# Altium schematic sheet S7CAS-PLEIADES-CARTE-MERE_P06_ETHERNET.SCHDOC
size Tabloid; SheetNumber: 11; SheetTotal: 18; Sheet_Name: ETHERNET; Size: 11x17
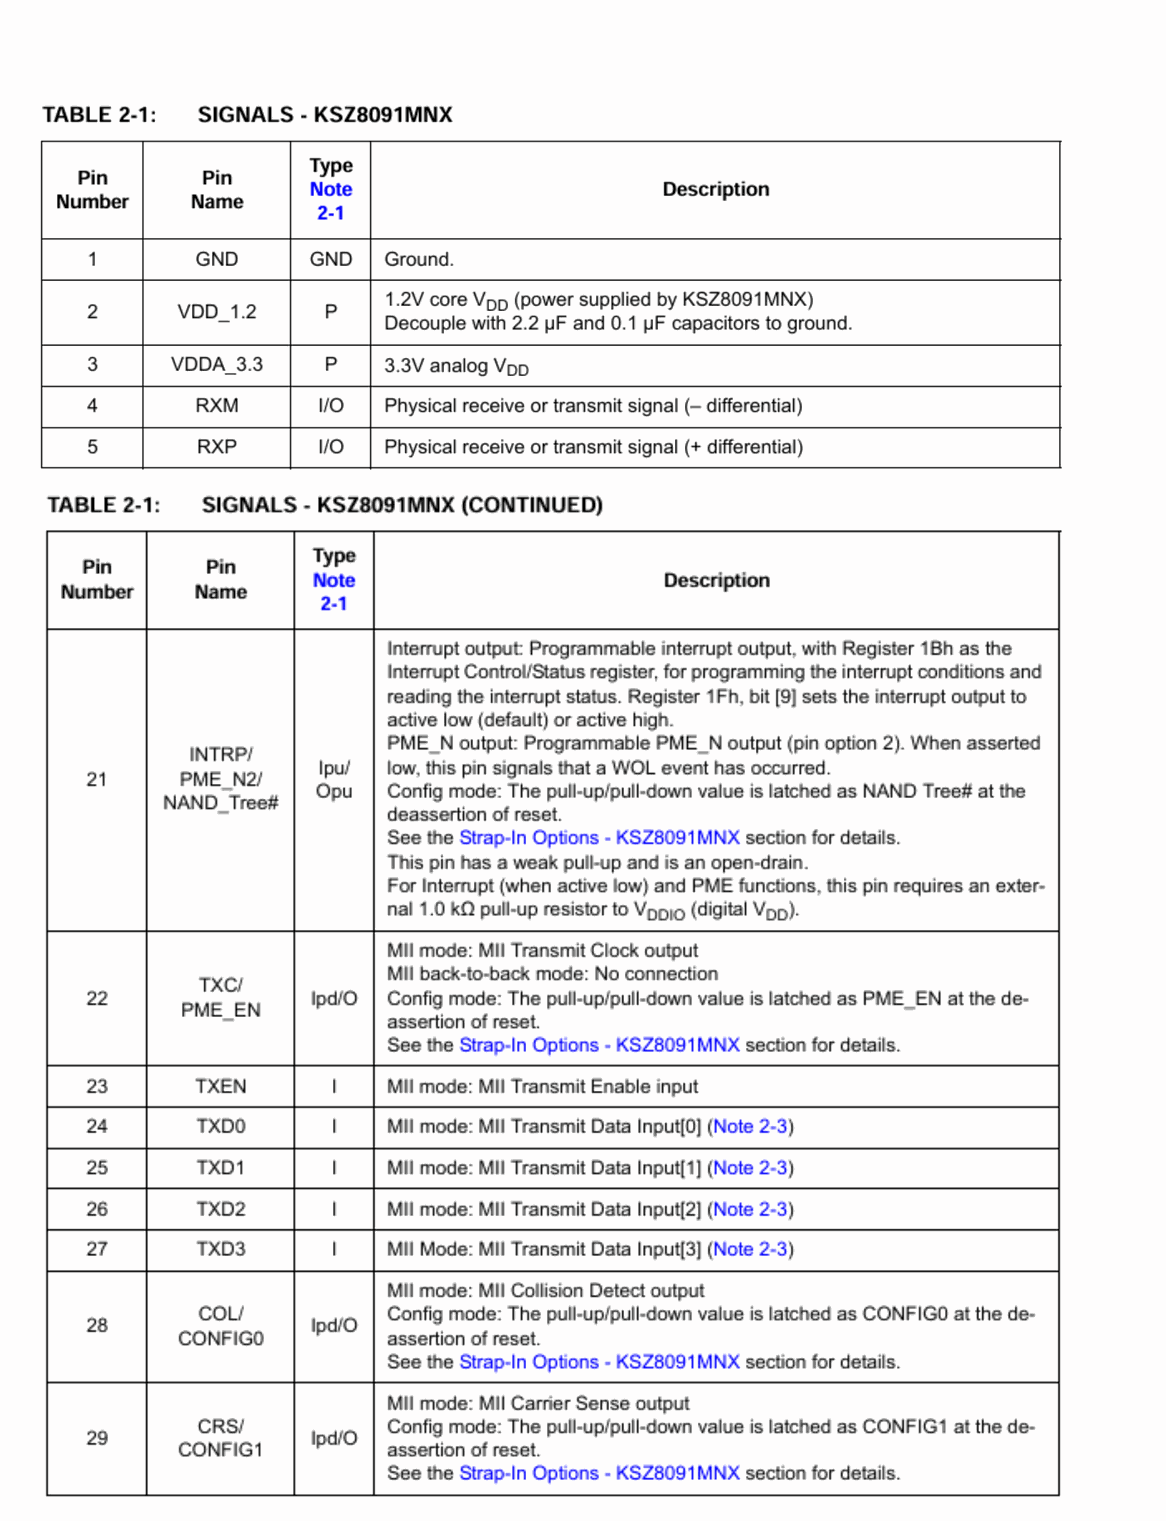
[diagram p0: S7CAS-PLEIADES-CARTE-MERE_P06_ETHERNET.SCHDOC, top left]
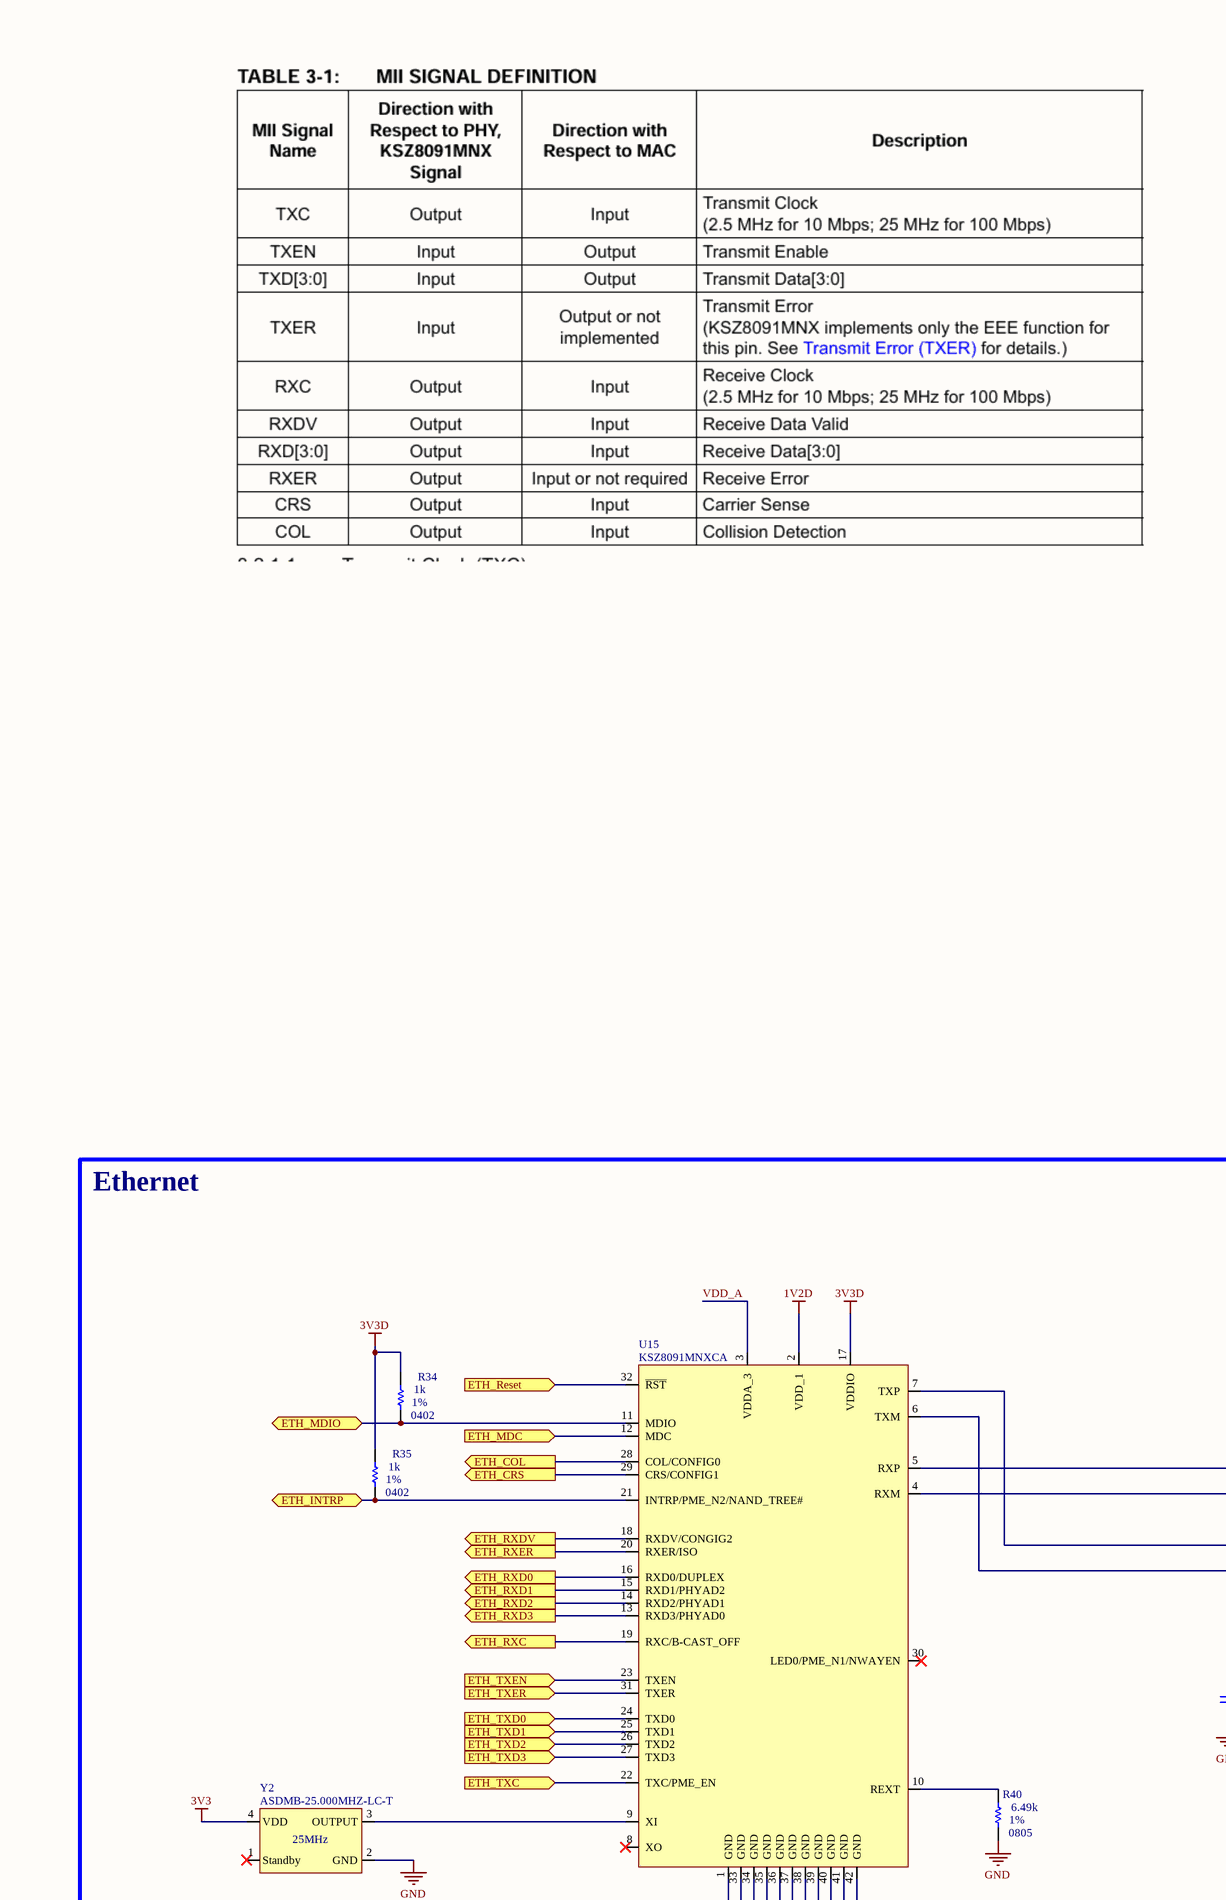
[diagram p1: S7CAS-PLEIADES-CARTE-MERE_P06_ETHERNET.SCHDOC, top middle]
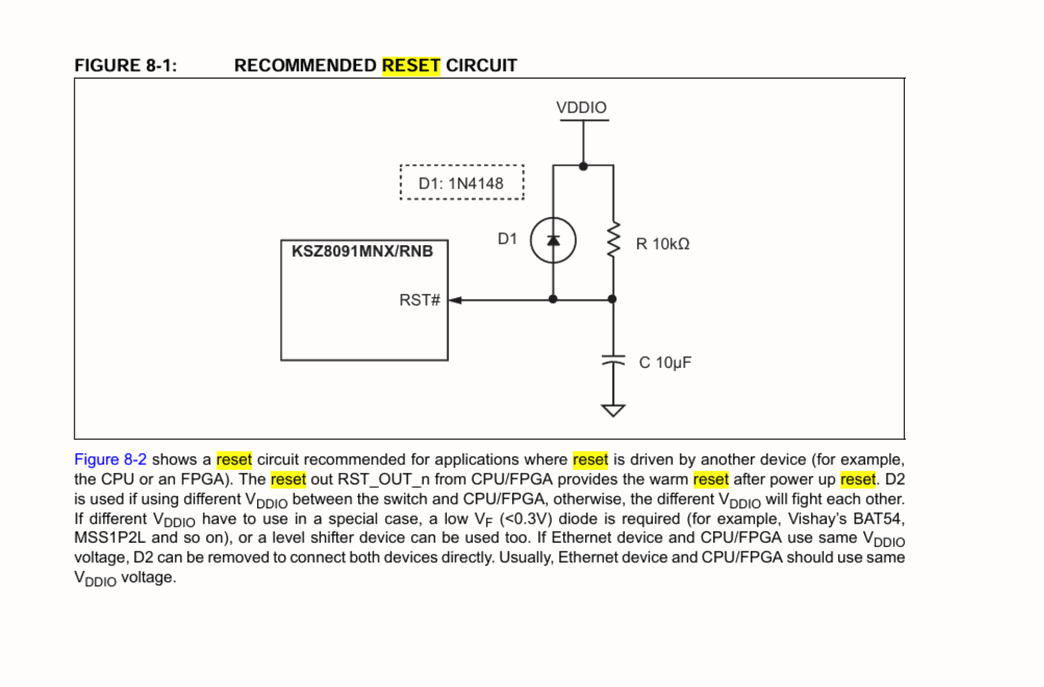
[diagram p2: S7CAS-PLEIADES-CARTE-MERE_P06_ETHERNET.SCHDOC, top right]
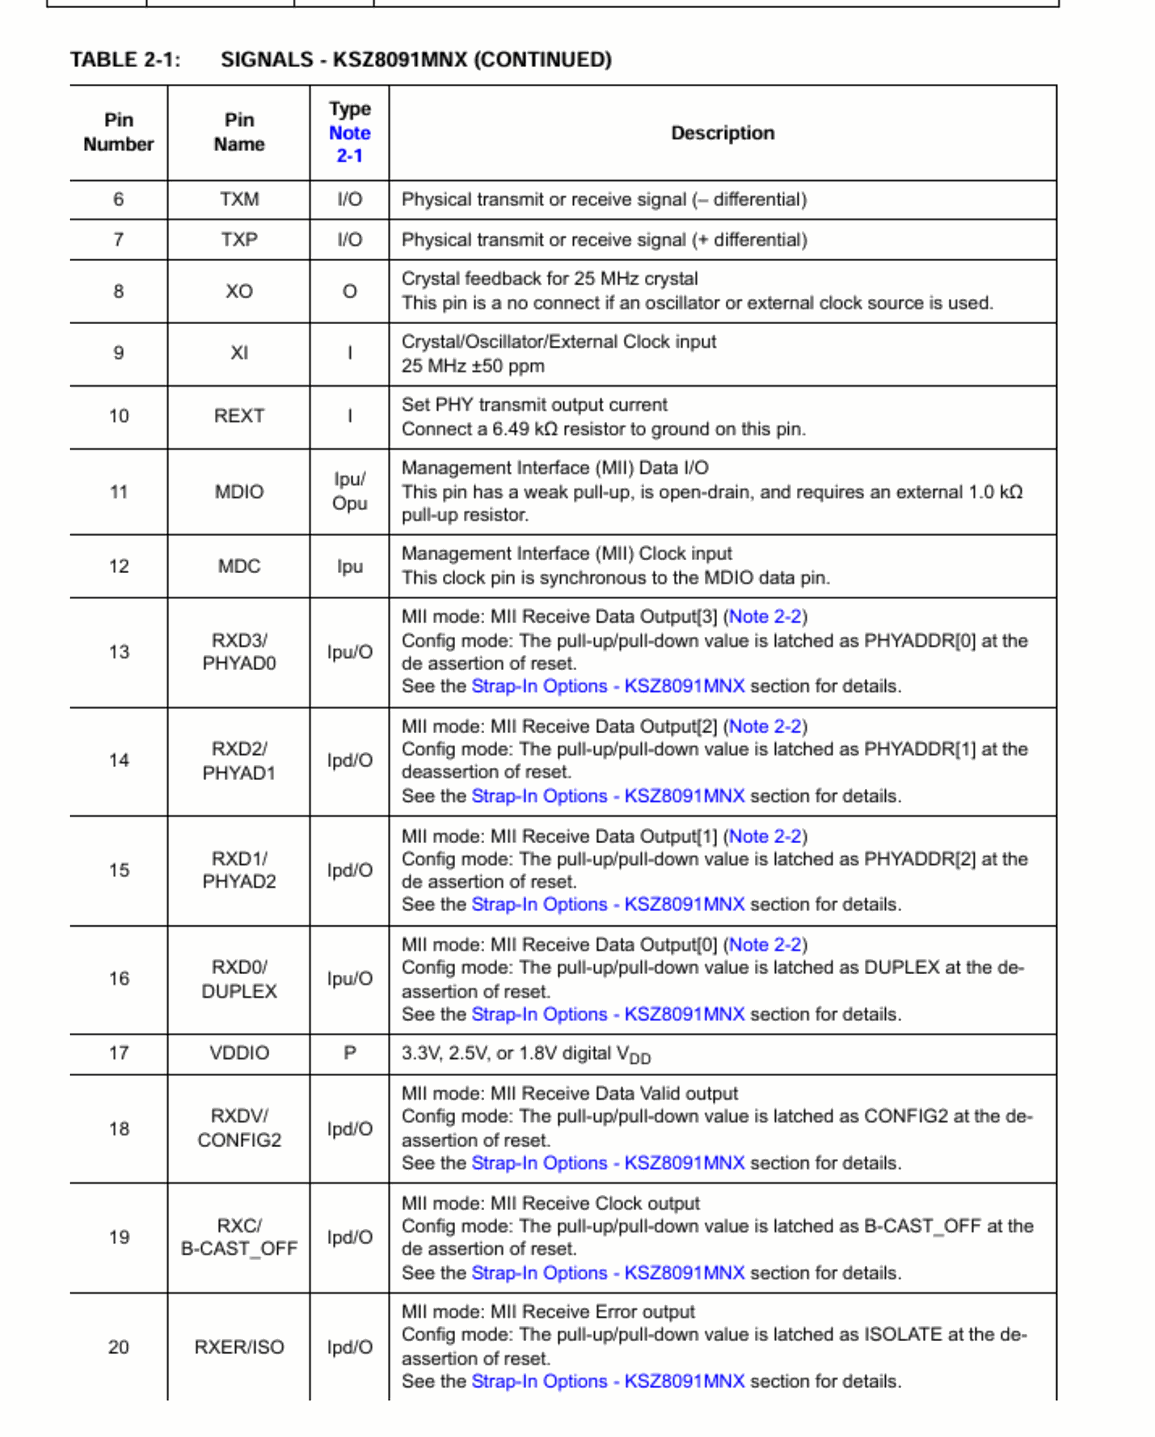
[diagram p3: S7CAS-PLEIADES-CARTE-MERE_P06_ETHERNET.SCHDOC, bottom left]
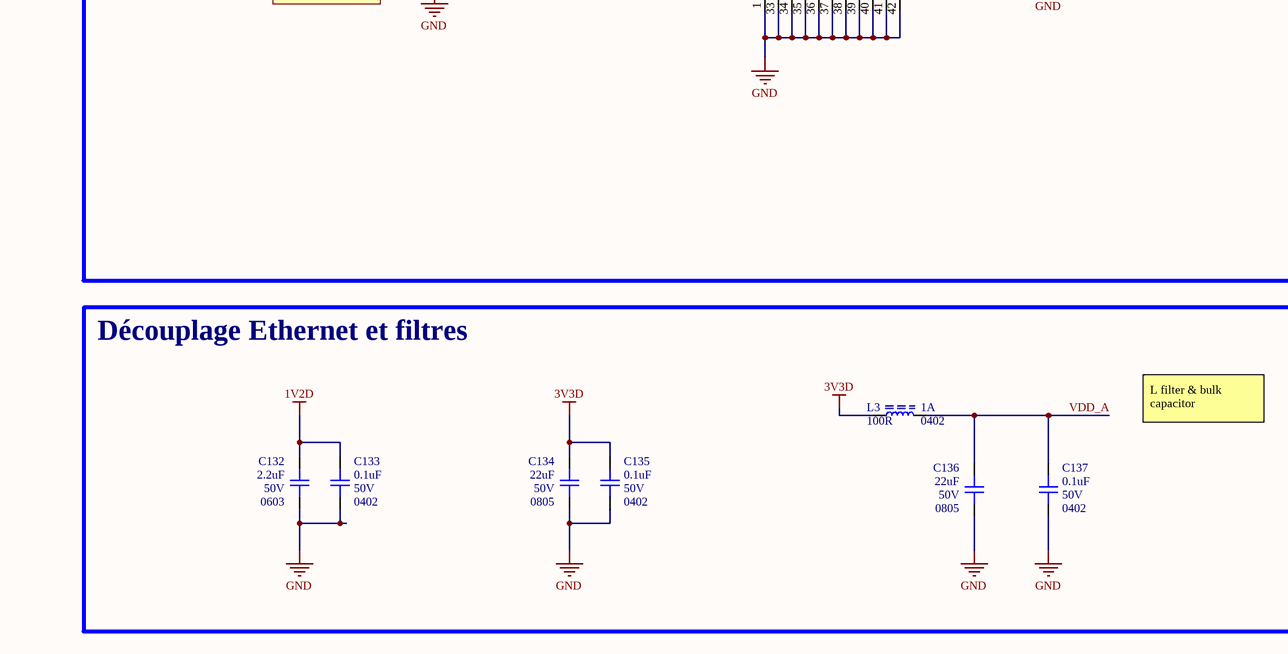
[diagram p4: S7CAS-PLEIADES-CARTE-MERE_P06_ETHERNET.SCHDOC, bottom middle]
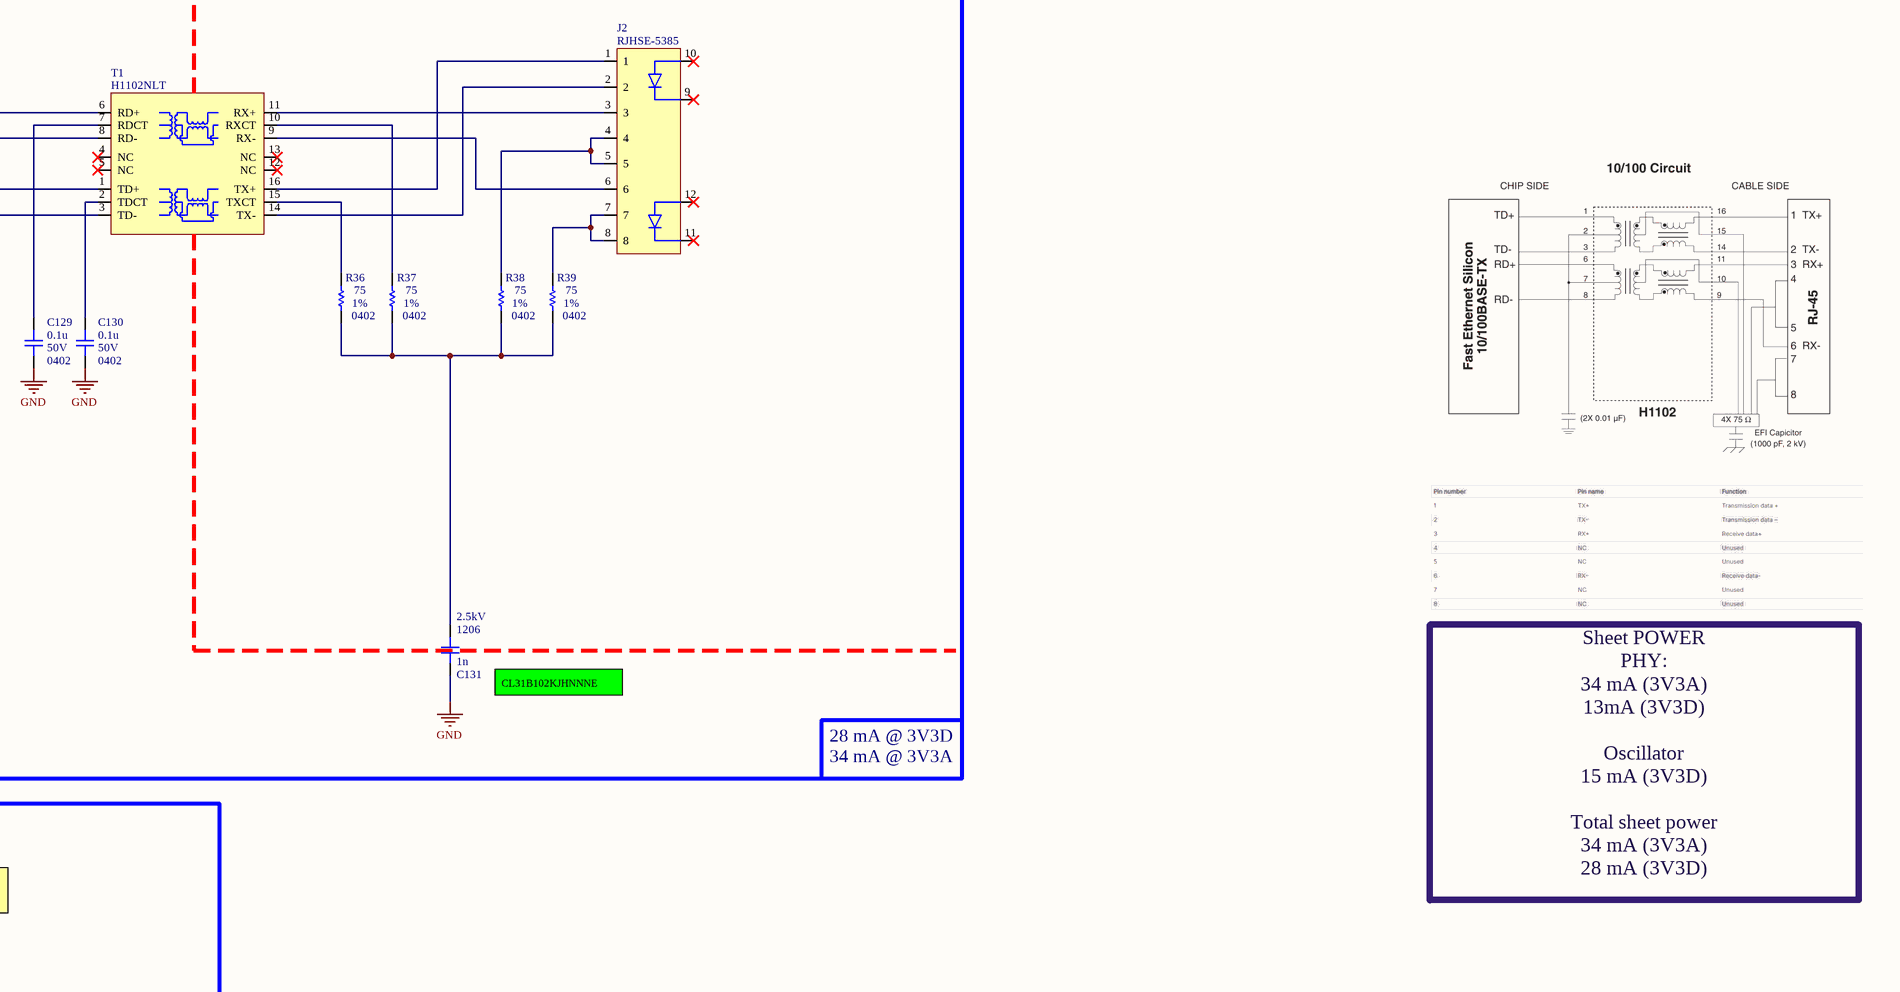
[diagram p5: S7CAS-PLEIADES-CARTE-MERE_P06_ETHERNET.SCHDOC, bottom right]

## Parts
C129  value 0.1u  Voltage: 50V  Package: 0402  [CAP_0402]  (hidden comment: CAP - 0402)
C130  value 0.1u  Voltage: 50V  Package: 0402  [CAP_0402]  (hidden comment: CAP - 0402)
C131  value 1n  Voltage: 2.5kV  Package: 1206  [CAP_0402]  (hidden comment: CAP - 0402)
C132  value 2.2uF  Voltage: 50V  Package: 0603  [CAP_0603]  (hidden comment: CAP - 0603)
C133  value 0.1uF  Voltage: 50V  Package: 0402  [CAP_0402]  (hidden comment: CAP - 0402)
C134  value 22uF  Voltage: 50V  Package: 0805  [CAP_0805]  (hidden comment: CAP - 0805)
C135  value 0.1uF  Voltage: 50V  Package: 0402  [CAP_0402]  (hidden comment: CAP - 0402)
C136  value 22uF  Voltage: 50V  Package: 0805  [CAP_0805]  (hidden comment: CAP - 0805)
C137  value 0.1uF  Voltage: 50V  Package: 0402  [CAP_0402]  (hidden comment: CAP - 0402)
J2  RJHSE-5385  [CONN_ETHERNET_RJHSE-5385]
L3  value 100R  Current: 1A  Package: 0402  [FER_0402]  (hidden comment: FER - 0402)
R34  value 1k  Package: 0402  Precision: 1%  [RES_0402]  (hidden comment: RES - 0402)
R35  value 1k  Package: 0402  Precision: 1%  [RES_0402]  (hidden comment: RES - 0402)
R36  value 75  Package: 0402  Precision: 1%  [RES_0402]  (hidden comment: RES - 0402)
R37  value 75  Package: 0402  Precision: 1%  [RES_0402]  (hidden comment: RES - 0402)
R38  value 75  Package: 0402  Precision: 1%  [RES_0402]  (hidden comment: RES - 0402)
R39  value 75  Package: 0402  Precision: 1%  [RES_0402]  (hidden comment: RES - 0402)
R40  value 6.49k  Package: 0805  Precision: 1%  [RES_0805]  (hidden comment: RES - 0805)
T1  H1102NLT  [TRANSFO_H1102NLT]
U15  KSZ8091MNXCA  [COM_ETH_PHY_KSZ8091MNXCA]
Y2  ASDMB-25.000MHZ-LC-T  [OSC_ASDMB-25.000MHZ-LC-T]

## Blocks framed on the sheet
Ethernet: C129-C131 J2 R34-R40 T1 U15 Y2
Découplage Ethernet et filtres: C132-C137 L3

## Ports
ETH_COL (out, see S7CAS-PLEIADES-CARTE-MERE_P06_FPGA3[1A]), ETH_CRS (out, see S7CAS-PLEIADES-CARTE-MERE_P06_FPGA3[1A]), ETH_INTRP (bidir, see S7CAS-PLEIADES-CARTE-MERE_P06_FPGA3[1B]), ETH_MDC (in, see S7CAS-PLEIADES-CARTE-MERE_P06_FPGA3[1A]), ETH_MDIO (bidir, see S7CAS-PLEIADES-CARTE-MERE_P06_FPGA3[1A]), ETH_Reset (in, see S7CAS-PLEIADES-CARTE-MERE_P06_FPGA3[1A]), ETH_RXC (out, see S7CAS-PLEIADES-CARTE-MERE_P06_FPGA3[1B]), ETH_RXD0 (out, see S7CAS-PLEIADES-CARTE-MERE_P06_FPGA3[1B]), ETH_RXD1 (out, see S7CAS-PLEIADES-CARTE-MERE_P06_FPGA3[1B]), ETH_RXD2 (out, see S7CAS-PLEIADES-CARTE-MERE_P06_FPGA3[1B]), ETH_RXD3 (out, see S7CAS-PLEIADES-CARTE-MERE_P06_FPGA3[1B]), ETH_RXDV (out, see S7CAS-PLEIADES-CARTE-MERE_P06_FPGA3[1B]), ETH_RXER (out, see S7CAS-PLEIADES-CARTE-MERE_P06_FPGA3[1B]), ETH_TXC (in, see S7CAS-PLEIADES-CARTE-MERE_P06_FPGA3[1B]), ETH_TXD0 (in, see S7CAS-PLEIADES-CARTE-MERE_P06_FPGA3[1B]), ETH_TXD1 (in, see S7CAS-PLEIADES-CARTE-MERE_P06_FPGA3[1B]), ETH_TXD2 (in, see S7CAS-PLEIADES-CARTE-MERE_P06_FPGA3[1B]), ETH_TXD3 (in, see S7CAS-PLEIADES-CARTE-MERE_P06_FPGA3[1B]), ETH_TXEN (in, see S7CAS-PLEIADES-CARTE-MERE_P06_FPGA3[1B]), ETH_TXER (in, see S7CAS-PLEIADES-CARTE-MERE_P06_FPGA3[1B])

## Nets
1V2D: C132.2 C133.2 U15.2(VDD_1)
3V3: Y2.4(VDD)
3V3D: C134.2 C135.2 L3.2 R34.2 R35.2 U15.17(VDDIO)
GND: C129.1 C130.1 C131.2 C132.1 C133.1 C134.1 C135.1 C136.1 C137.1 R40.1 U15.1(GND) U15.33(GND) U15.34(GND) U15.35(GND) U15.36(GND) U15.37(GND) U15.38(GND) U15.39(GND) U15.40(GND) U15.41(GND) U15.42(GND) Y2.2(GND)
ETH_COL: U15.28(COL/CONFIG0) ; port ETH_COL
ETH_CRS: U15.29(CRS/CONFIG1) ; port ETH_CRS
ETH_INTRP: R35.1 U15.21(INTRP/PME_N2/NAND_TREE#) ; port ETH_INTRP
ETH_MDC: U15.12(MDC) ; port ETH_MDC
ETH_MDIO: R34.1 U15.11(MDIO) ; port ETH_MDIO
ETH_Reset: U15.32(~{RST}) ; port ETH_Reset
ETH_RXC: U15.19(RXC/B-CAST_OFF) ; port ETH_RXC
ETH_RXD0: U15.16(RXD0/DUPLEX) ; port ETH_RXD0
ETH_RXD1: U15.15(RXD1/PHYAD2) ; port ETH_RXD1
ETH_RXD2: U15.14(RXD2/PHYAD1) ; port ETH_RXD2
ETH_RXD3: U15.13(RXD3/PHYAD0) ; port ETH_RXD3
ETH_RXDV: U15.18(RXDV/CONGIG2) ; port ETH_RXDV
ETH_RXER: U15.20(RXER/ISO) ; port ETH_RXER
ETH_TXC: U15.22(TXC/PME_EN) ; port ETH_TXC
ETH_TXD0: U15.24(TXD0) ; port ETH_TXD0
ETH_TXD1: U15.25(TXD1) ; port ETH_TXD1
ETH_TXD2: U15.26(TXD2) ; port ETH_TXD2
ETH_TXD3: U15.27(TXD3) ; port ETH_TXD3
ETH_TXEN: U15.23(TXEN) ; port ETH_TXEN
ETH_TXER: U15.31(TXER) ; port ETH_TXER
VDD_A: C136.2 C137.2 L3.1 U15.3(VDDA_3)
NetC129_2: C129.2 T1.7(RDCT)
NetC130_2: C130.2 T1.2(TDCT)
NetC131_1: C131.1 R36.1 R37.1 R38.1 R39.1
NetJ2_1: J2.1 T1.16(TX+)
NetJ2_2: J2.2 T1.14(TX-)
NetJ2_3: J2.3 T1.11(RX+)
NetJ2_4: J2.4 J2.5 R38.2
NetJ2_6: J2.6 T1.9(RX-)
NetJ2_7: J2.7 J2.8 R39.2
NetR36_2: R36.2 T1.15(TXCT)
NetR37_2: R37.2 T1.10(RXCT)
NetR40_2: R40.2 U15.10(REXT)
NetT1_1: T1.1(TD+) U15.7(TXP)
NetT1_3: T1.3(TD-) U15.6(TXM)
NetT1_6: T1.6(RD+) U15.5(RXP)
NetT1_8: T1.8(RD-) U15.4(RXM)
NetU15_9: U15.9(XI) Y2.3(OUTPUT)

Not connected (* = marked no-connect by the designer): J2 9(LED1_K)* 10(LED1_A)* 11(LED2_K)* 12(LED2_A)*; T1 4(NC)* 5(NC)* 12(NC)* 13(NC)*; U15 8(XO)* 30(LED0/PME_N1/NWAYEN)*; Y2 1(Standby)*

## Notes on the sheet
- (near C131) CL31B102KJHNNNE
- 28 mA @ 3V3D
  34 mA @ 3V3A
- L filter & bulk capacitor
- Sheet POWER
  PHY:
  34 mA (3V3A)
  13mA (3V3D)
  Oscillator
  15 mA (3V3D)
  Total sheet power
  34 mA (3V3A)
  28 mA (3V3D)
- Sheet Name
- Project Title
- Global Project
- Size
- Group
- Revision
- Date
- Sheet
- of
- Filename
- Designers

## Library data of the parts
C129-C131 C133 C135 C137 = CAP - 0402: Precision: 10%; Current: *; CreatedBy: Jonathan Bouchard; Power: *
C132 = CAP - 0603: Precision: 10%; Current: *; CreatedBy: Jonathan Bouchard; Power: *
C134 C136 = CAP - 0805: Precision: 10%; Current: *; CreatedBy: Jonathan Bouchard; Power: *
J2 = CONN_ETHERNET_RJHSE-5385: CONN - MOD JACK RJ45 R/A ETHERNET - TH; Mfg: Amphenol; Voltage: *; Current: *; Power: *; Mfg Part Number: RJHSE-5385; HelpURL: https://www.amphenolcanada.com/ProductSearch/drawings/AC/RJHSE538X.pdf; CreatedBy: Jonathan Bouchard; Temperature: -55°C ~ 85°C; Value: *; Precision: *; Package: TH-12; Supplier 1: Digikey; Supplier Part Number 1: RJHSE-5385-ND
R34-R39 = RES - 0402: Voltage: 50V; Power: 1/16W; Current: *; CreatedBy: Jonathan Bouchard
T1 = TRANSFO_H1102NLT: TRANSFO - ETHERNET 10/100B-TX - SMD-16; Mfg: Pulse Eng.; Value: 1:1 (350uH); Voltage: *; Current: *; Power: *; Mfg Part Number: H1102NLT; HelpURL: http://media.digikey.com/pdf/Data%20Sheets/Pulse%20PDFs/10_100BASE-T%20Single%20Port%20SMD%20Magnetics_Rev2008.pdf; CreatedBy: Jonathan Bouchard; Temperature: -40°C to 85°C; Precision: *; Package: SMD-16; Supplier 1: Digikey; Supplier Part Number 1: 553-1532-1-ND
U15 = COM_ETH_PHY_KSZ8091MNXCA: COM - ETHERNET PHY 10/100 - QFN-32; Voltage: 1.8V, 2.5V, 3.3V; Mfg: Micrel; Current: *; Power: *; Mfg Part Number: KSZ8091MNXCA; HelpURL: http://ww1.microchip.com/downloads/en/DeviceDoc/00002275A.pdf; CreatedBy: Jonathan Bouchard; Temperature: 0°C ~ 70°C; Value: *; Precision: *; Package: QFN-32; Supplier 1: Digikey; Supplier Part Number 1: 576-4356-ND
Y2 = OSC_ASDMB-25.000MHZ-LC-T: OSC - 25MHz XO (Standard) LVCMOS - 4-SMD, No Lead; Manufacturer #1: Abracon LLC; Tolerance: ±50ppm; Voltage Rating: 1.8V ~ 3.3V; GRAMS Lib Spec: 2.8; Magnetic Material: Unknown; Polarized: Yes; Value: 25MHz; Current Rating: *; Power Max: *; HelpURL: https://abracon.com/Oscillators/ASDMB.pdf; CreatedBy/Date: Joël Lemay 2019-03-29; VerifiedBy: C. Paulin - 29 mai 2019; Temperature: -40°C ~ +85°C; Package: 4-SMD, No Lead; Manufacturer #2: *; Note: *; Assembly Type: SMD; Part Number #2: *; Part Number #1: ASDMB-25.000MHZ-LC-T; Supplier 1: Digi-Key; Supplier Part Number 1: 535-11730-1-ND; Cryo: UNKNOWN
L3 = FER - 0402: Voltage: *; CreatedBy: Jonathan Bouchard; Power: *; Precision: *
R40 = RES - 0805: Current: *; CreatedBy: Jonathan Bouchard